# EAGLE schematic Activities (EAGLE 7.4.0)
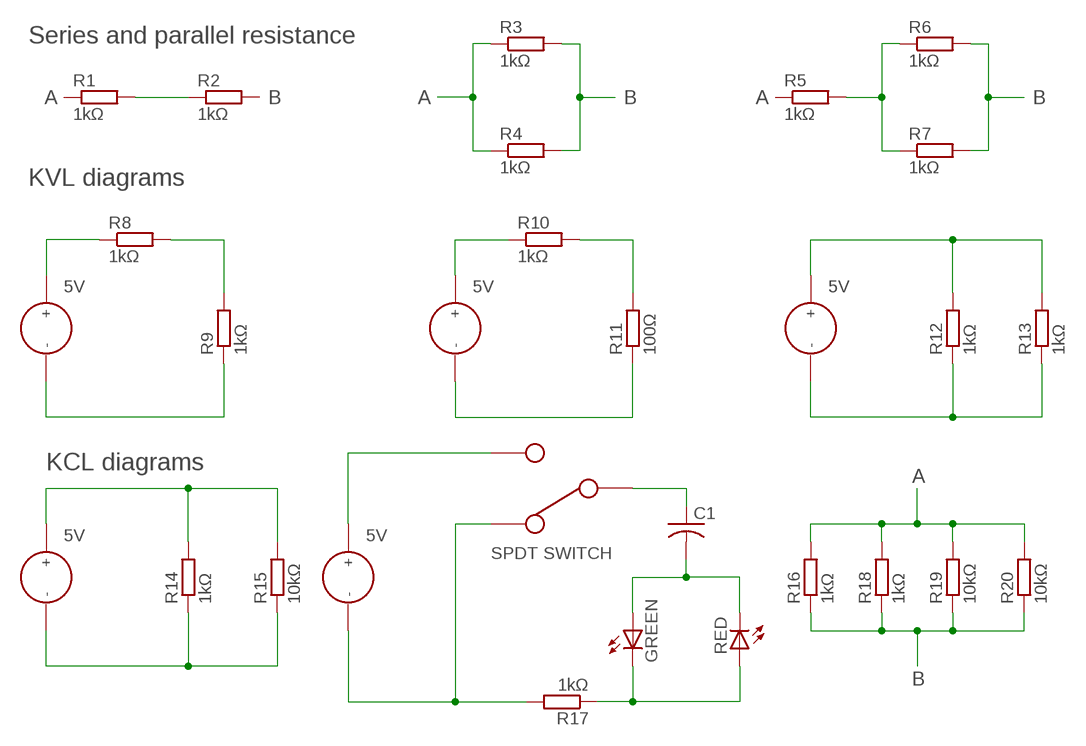
[diagram p0: schematic, sheet 1]

## Parts
C1  C-US025-025X050  [C025-025X050]
GREEN  LED3MM  [LED3MM]
R1  1kΩ  R-EU_0207/10  [0207/10]
R2  1kΩ  R-EU_0207/10  [0207/10]
R3  1kΩ  R-EU_0207/10  [0207/10]
R4  1kΩ  R-EU_0207/10  [0207/10]
R5  1kΩ  R-EU_0207/10  [0207/10]
R6  1kΩ  R-EU_0207/10  [0207/10]
R7  1kΩ  R-EU_0207/10  [0207/10]
R8  1kΩ  R-EU_0207/10  [0207/10]
R9  1kΩ  R-EU_0207/10  [0207/10]
R10  1kΩ  R-EU_0207/10  [0207/10]
R11  100Ω  R-EU_0207/10  [0207/10]
R12  1kΩ  R-EU_0207/10  [0207/10]
R13  1kΩ  R-EU_0207/10  [0207/10]
R14  1kΩ  R-EU_0207/10  [0207/10]
R15  10kΩ  R-EU_0207/10  [0207/10]
R16  1kΩ  R-EU_0207/10  [0207/10]
R17  1kΩ  R-EU_0207/10  [0207/10]
R18  1kΩ  R-EU_0207/10  [0207/10]
R19  10kΩ  R-EU_0207/10  [0207/10]
R20  10kΩ  R-EU_0207/10  [0207/10]
RED  LED3MM  [LED3MM]
U$1  SPDT  [SPDT]
V1  5V  VOLTAGE_SOURCE  [VOLTAGE_SOURCE]
V2  5V  VOLTAGE_SOURCE  [VOLTAGE_SOURCE]
V3  5V  VOLTAGE_SOURCE  [VOLTAGE_SOURCE]
V7  5V  VOLTAGE_SOURCE  [VOLTAGE_SOURCE]
V8  5V  VOLTAGE_SOURCE  [VOLTAGE_SOURCE]

## Nets
N$1: R1.2 R2.1
N$2: R3.1 R4.1
N$3: R3.2 R4.2
N$4: R5.2 R6.1 R7.1
N$5: R6.2 R7.2
N$6: R8.1 V1.1(+)
N$7: R8.2 R9.2
N$8: R9.1 V1.2(-)
N$9: R11.1 V2.2(-)
N$10: R10.2 R11.2
N$11: R10.1 V2.1(+)
N$12: R12.2 R13.2 V3.1(+)
N$13: R12.1 R13.1 V3.2(-)
N$14: R16.2 R18.2 R19.2 R20.2
N$15: R16.1 R18.1 R19.1 R20.1
N$20: R17.2 U$1.P$2(B) V8.2(-)
N$21: U$1.P$1(A) V8.1(+)
N$22: C1.1 U$1.P$3(IN)
N$23: C1.2 GREEN.A RED.K(C)
N$25: GREEN.K(C) R17.1 RED.A
N$28: R14.2 R15.2 V7.1(+)
N$29: R14.1 R15.1 V7.2(-)
Unconnected: R1.1 R2.2 R5.1

## Notes on the sheet
- Series and parallel resistance
- A | B | A | B | A | B
- KVL diagrams
- KCL diagrams
- A
- SPDT SWITCH
- B

## Library data of the parts
C1 = rcl:C-US: CAPACITOR, American symbol
GREEN RED = led:LED: LED OSRAM: - CHIPLED LG R971, LG N971, LY N971, LG Q971, LY Q971, LO R971, LY R971 LH N974, LH R974 LS Q976, LO Q976, LY Q976 LO Q996 - Hyper CHIPLED LW Q18S LB Q993, LB Q99A, LB R99A - SideLED LS A670, LO A670, LY A670, LG A670, LP A670 LB A673, LV A673, LT A673, LW A673 LH A674 LY A675 LS A676, LA A676, LO A676, LY A676, LW A676 LS A679, LY A679, LG A679 - Hyper Micro SIDELED® LS Y876, LA Y876, LO Y876, LY Y876 LT Y87S - SmartLED LW L88C, LW L88S LB L89C, LB L89S, LG L890 LS L89K, LO L89K, LY L89K LS L896, LA L896, LO L896, LY L896 - TOPLED LS T670, LO T670, LY T670, LG T670, LP T670 LSG T670, LSP T670, LSY T670, LOP T670, LYG T670 LG T671, LOG T671, LSG T671 LB T673, LV T673, LT T673, LW T673 LH T674 LS T676, LA T676, LO T676, LY T676, LB T676, LH T676, LSB T676, LW T676 LB T67C, LV T67C, LT T67C, LS T67K, LO T67K, LY T67K, LW E67C LS E67B, LA E67B, LO E67B, LY E67B, LB E67C, LV E67C, LT E67C LW T67C LS T679, LY T679, LG T679 LS T770, LO T770, LY T770, LG T770, LP T770 LB T773, LV T773, LT T773, LW T773 LH T774 LS E675, LA E675, LY E675, LS T675 LS T776, LA T776, LO T776, LY T776, LB T776 LHGB T686 LT T68C, LB T68C - Hyper Mini TOPLED® LB M676 - Mini TOPLED Santana® LG M470 LS M47K, LO M47K, LY M47K Source: http://www.osram.convergy.de LUXEON: - LUMILED® LXK2-PW12-R00, LXK2-PW12-S00, LXK2-PW14-U00, LXK2-PW14-V00 LXK2-PM12-R00, LXK2-PM12-S00, LXK2-PM14-U00 LXK2-PE12-Q00, LXK2-PE12-R00, LXK2-PE12-S00, LXK2-PE14-T00, LXK2-PE14-U00 LXK2-PB12-K00, LXK2-PB12-L00, LXK2-PB12-M00, LXK2-PB14-N00, LXK2-PB14-P00, LXK2-PB14-Q00 LXK2-PR12-L00, LXK2-PR12-M00, LXK2-PR14-Q00, LXK2-PR14-R00 LXK2-PD12-Q00, LXK2-PD12-R00, LXK2-PD12-S00 LXK2-PH12-R00, LXK2-PH12-S00 LXK2-PL12-P00, LXK2-PL12-Q00, LXK2-PL12-R00 Source: www.luxeon.com KINGBRIGHT: KA-3528ASYC Source: www.kingbright.com
R1-R20 = rcl:R-EU_: RESISTOR, European symbol
U$1 = another:SPDT
V1-V3 V7 V8 = personal:VOLTAGE_SOURCE